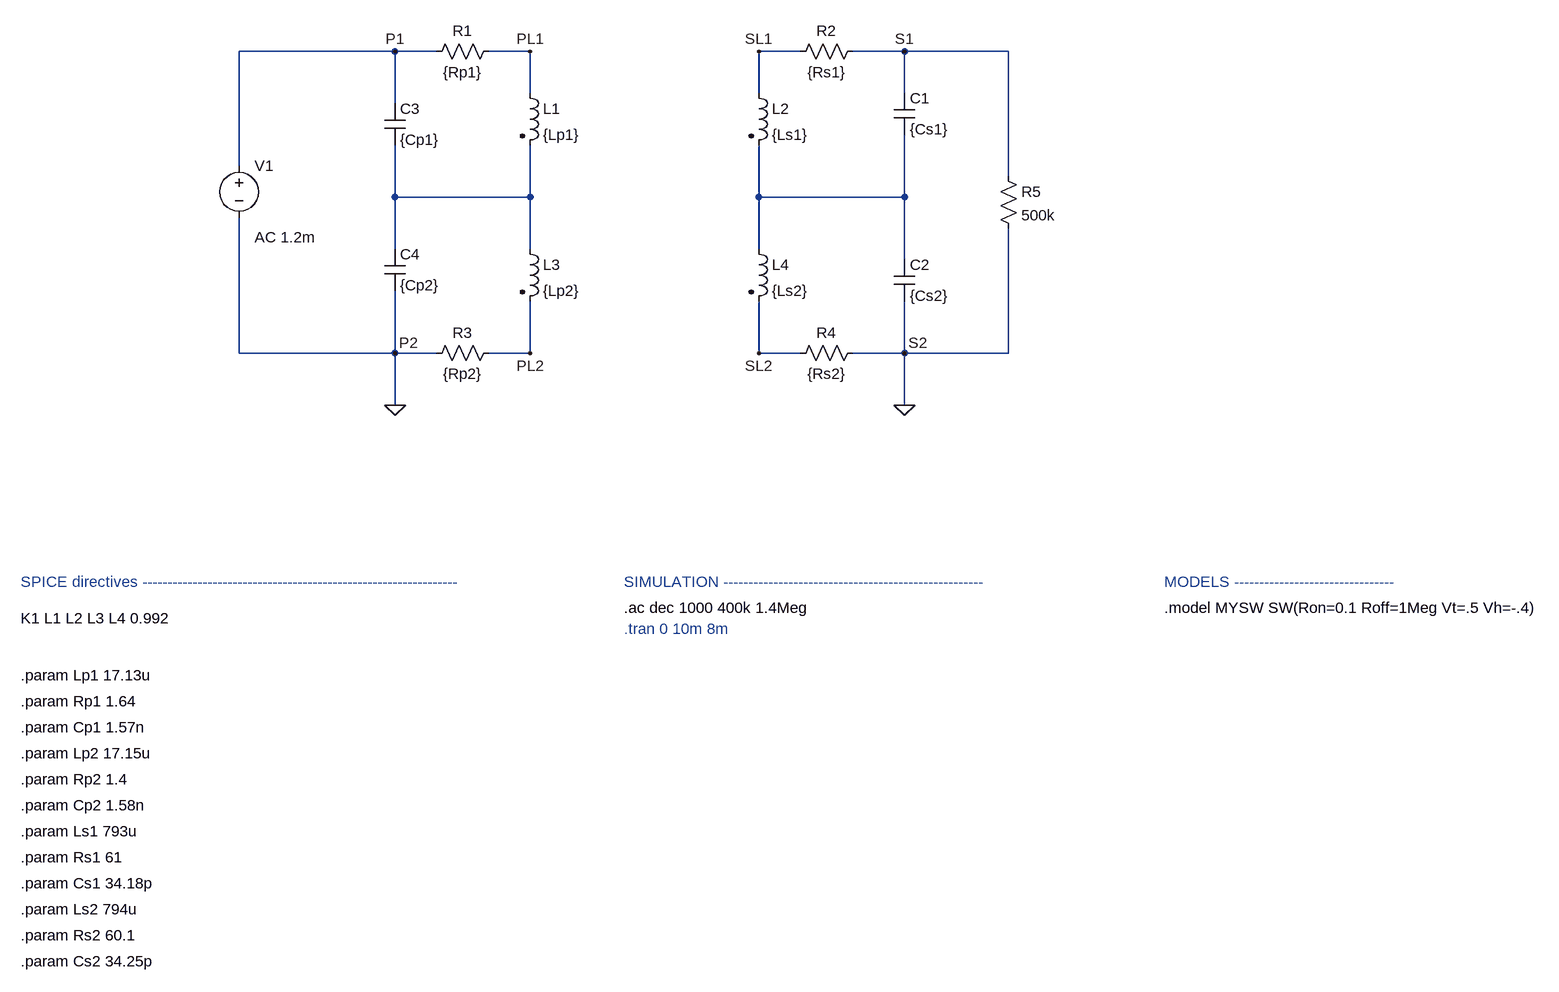
[diagram p0: schematic 3-transformer_model.asc]
3-transformer_model.asc, the LTspice schematic file:
Version 4
SHEET 1 1868 1476
WIRE 16 -64 -224 -64
WIRE 80 -64 16 -64
WIRE 224 -64 160 -64
WIRE 640 -64 576 -64
WIRE 800 -64 720 -64
WIRE 960 -64 800 -64
WIRE 224 0 224 -64
WIRE 576 0 576 -64
WIRE 800 0 800 -64
WIRE 16 16 16 -64
WIRE -224 112 -224 -64
WIRE 960 128 960 -64
WIRE 16 160 16 80
WIRE 224 160 224 80
WIRE 224 160 16 160
WIRE 576 160 576 80
WIRE 800 160 800 64
WIRE 800 160 576 160
WIRE 16 240 16 160
WIRE 224 240 224 160
WIRE 576 240 576 160
WIRE 800 256 800 160
WIRE -224 400 -224 192
WIRE 16 400 16 304
WIRE 16 400 -224 400
WIRE 80 400 16 400
WIRE 224 400 224 320
WIRE 224 400 160 400
WIRE 576 400 576 320
WIRE 640 400 576 400
WIRE 800 400 800 320
WIRE 800 400 720 400
WIRE 960 400 960 208
WIRE 960 400 800 400
WIRE 16 480 16 400
WIRE 800 480 800 400
FLAG 224 -64 PL1
FLAG 576 -64 SL1
FLAG 800 -64 S1
FLAG 16 -64 P1
FLAG 224 400 PL2
FLAG 576 400 SL2
FLAG 800 400 S2
FLAG 16 400 P2
FLAG 16 480 0
FLAG 800 480 0
SYMBOL ind2 208 -16 R0
SYMATTR InstName L1
SYMATTR Value {Lp1}
SYMATTR Type ind
SYMBOL ind2 560 -16 R0
SYMATTR InstName L2
SYMATTR Value {Ls1}
SYMATTR Type ind
SYMBOL res 176 -80 R90
WINDOW 0 0 56 VBottom 2
WINDOW 3 32 56 VTop 2
SYMATTR InstName R1
SYMATTR Value {Rp1}
SYMBOL res 736 -80 R90
WINDOW 0 0 56 VBottom 2
WINDOW 3 32 56 VTop 2
SYMATTR InstName R2
SYMATTR Value {Rs1}
SYMBOL cap 784 0 R0
SYMATTR InstName C1
SYMATTR Value {Cs1}
SYMBOL ind2 208 224 R0
SYMATTR InstName L3
SYMATTR Value {Lp2}
SYMATTR Type ind
SYMBOL ind2 560 224 R0
SYMATTR InstName L4
SYMATTR Value {Ls2}
SYMATTR Type ind
SYMBOL res 176 384 R90
WINDOW 0 0 56 VBottom 2
WINDOW 3 32 56 VTop 2
SYMATTR InstName R3
SYMATTR Value {Rp2}
SYMBOL res 736 384 R90
WINDOW 0 0 56 VBottom 2
WINDOW 3 32 56 VTop 2
SYMATTR InstName R4
SYMATTR Value {Rs2}
SYMBOL cap 784 256 R0
SYMATTR InstName C2
SYMATTR Value {Cs2}
SYMBOL voltage -224 96 R0
WINDOW 123 24 126 Left 2
WINDOW 39 0 0 Left 0
SYMATTR Value2 AC 1.2m
SYMATTR InstName V1
SYMATTR Value ""
SYMBOL res 944 112 R0
SYMATTR InstName R5
SYMATTR Value 500k
SYMBOL cap 0 16 R0
SYMATTR InstName C3
SYMATTR Value {Cp1}
SYMBOL cap 0 240 R0
SYMATTR InstName C4
SYMATTR Value {Cp2}
TEXT 368 792 Left 2 !.ac dec 1000 400k 1.4Meg
TEXT 368 752 Left 2 ;SIMULATION ----------------------------------------------------
TEXT 1200 792 Left 2 !.model MYSW SW(Ron=0.1 Roff=1Meg Vt=.5 Vh=-.4)
TEXT 1200 752 Left 2 ;MODELS --------------------------------
TEXT 368 824 Left 2 ;.tran 0 10m 8m
TEXT -560 752 Left 2 ;SPICE directives ---------------------------------------------------------------
TEXT -560 808 Left 2 !K1 L1 L2 L3 L4 0.992
TEXT -560 896 Left 2 !.param Lp1 17.13u
TEXT -560 976 Left 2 !.param Cp1 1.57n
TEXT -560 936 Left 2 !.param Rp1 1.64
TEXT -560 1016 Left 2 !.param Lp2 17.15u
TEXT -560 1096 Left 2 !.param Cp2 1.58n
TEXT -560 1056 Left 2 !.param Rp2 1.4
TEXT -560 1136 Left 2 !.param Ls1 793u
TEXT -560 1216 Left 2 !.param Cs1 34.18p
TEXT -560 1176 Left 2 !.param Rs1 61
TEXT -560 1256 Left 2 !.param Ls2 794u
TEXT -560 1336 Left 2 !.param Cs2 34.25p
TEXT -560 1296 Left 2 !.param Rs2 60.1

The netlist it stands for:
* 3-transformer_model.asc
L1 PL1 N001 {Lp1}
L2 SL1 N002 {Ls1}
R1 PL1 P1 {Rp1}
R2 S1 SL1 {Rs1}
C1 S1 N002 {Cs1}
L3 N001 PL2 {Lp2}
L4 N002 SL2 {Ls2}
R3 PL2 0 {Rp2}
R4 0 SL2 {Rs2}
C2 N002 0 {Cs2}
V1 P1 0 AC 1.2m
R5 S1 0 500k
C3 P1 N001 {Cp1}
C4 N001 0 {Cp2}
.ac dec 1000 400k 1.4Meg
* SIMULATION ----------------------------------------------------
.model MYSW SW(Ron=0.1 Roff=1Meg Vt=.5 Vh=-.4)
* MODELS --------------------------------
* .tran 0 10m 8m
* SPICE directives ---------------------------------------------------------------
K1 L1 L2 L3 L4 0.992
.param Lp1 17.13u
.param Cp1 1.57n
.param Rp1 1.64
.param Lp2 17.15u
.param Cp2 1.58n
.param Rp2 1.4
.param Ls1 793u
.param Cs1 34.18p
.param Rs1 61
.param Ls2 794u
.param Cs2 34.25p
.param Rs2 60.1
.backanno
.end